# Altium schematic sheet Pi_Power.SchDoc
size A; SheetNumber: 4; SheetTotal: 10
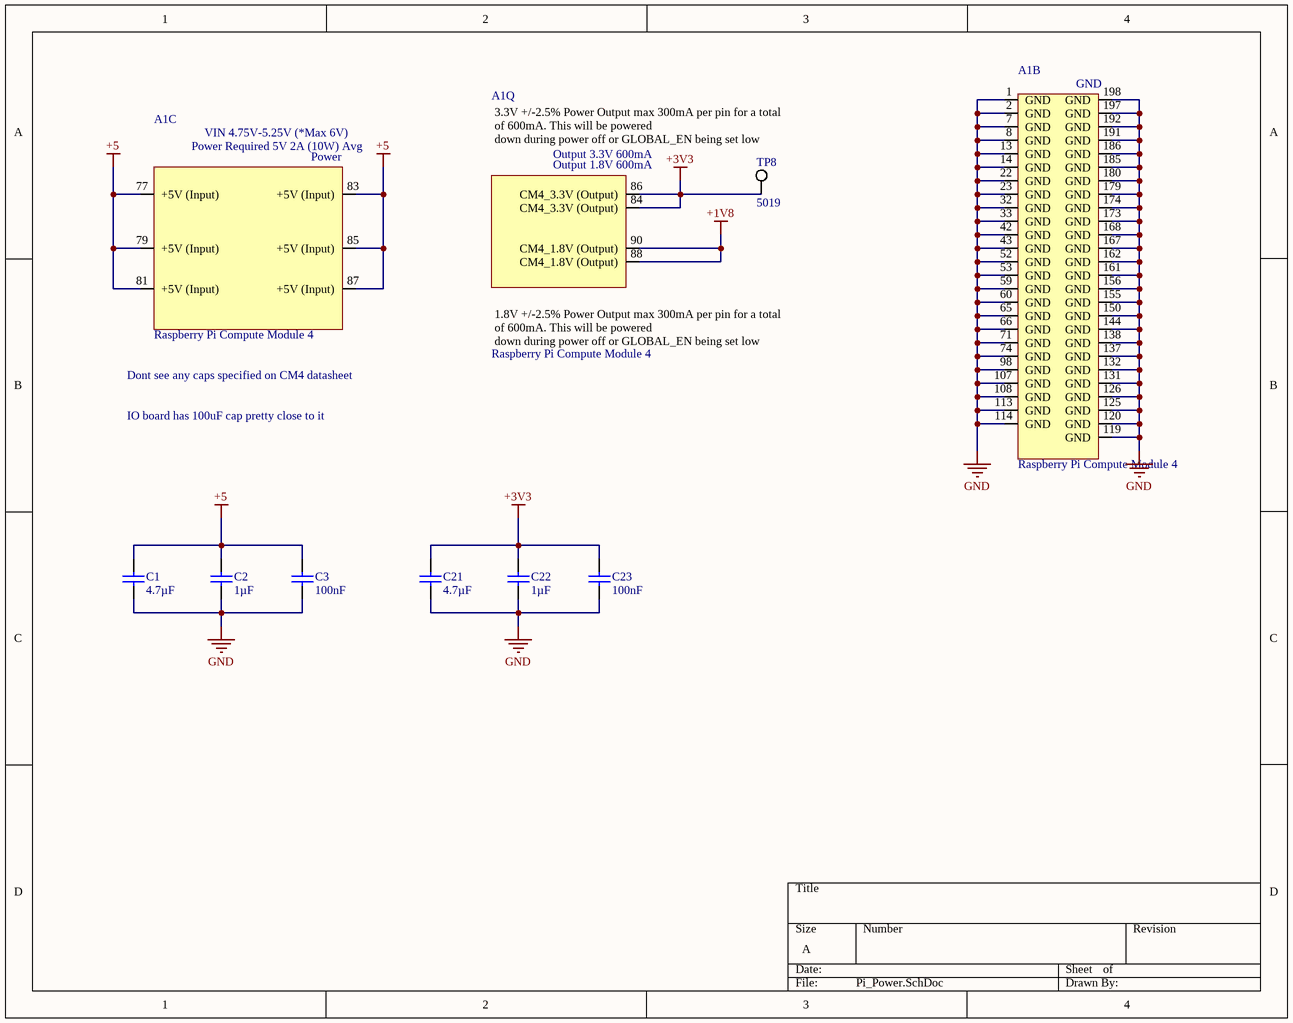
[diagram p0: Pi_Power.SchDoc]

## Parts
A1  Raspberry Pi Compute Module 4  [CM4-F40C-100DS-0.4v_1.5mm_0mm]  (parts B,C,Q of 21)  (no BOM)
C1  value 4.7µF  [CAPC0603(1608)100_L]  (hidden comment: Capacitor 4.7µF +/-20% 10V 0603)
C2  value 1µF  [CAPC1608X94X35NL15T15]  (hidden comment: Capacitor 1 uF +/- 10% 16 V 0603)
C3  value 100nF  [CAPC1005X56X25LL10T15]  (hidden comment: Capacitor 0.1 uF +/- 5% 16 V 0402)
C21  value 4.7µF  [CAPC0603(1608)100_L]  (hidden comment: Capacitor 4.7µF +/-20% 10V 0603)
C22  value 1µF  [CAPC1608X94X35NL15T15]  (hidden comment: Capacitor 1 uF +/- 10% 16 V 0603)
C23  value 100nF  [CAPC1005X56X25LL10T15]  (hidden comment: Capacitor 0.1 uF +/- 5% 16 V 0402)
TP8  5019  [KSTN-5019_V]

## Nets
+1V8: A1.88(CM4_1.8V_(Output)) A1.90(CM4_1.8V_(Output))
+3V3: A1.84(CM4_3.3V_(Output)) A1.86(CM4_3.3V_(Output)) C21.2 C22.2 C23.2 TP8.1
+5: A1.77(+5V_(Input)) A1.79(+5V_(Input)) A1.81(+5V_(Input)) A1.83(+5V_(Input)) A1.85(+5V_(Input)) A1.87(+5V_(Input)) C1.2 C2.2 C3.2
GND: A1.1(GND) A1.2(GND) A1.7(GND) A1.8(GND) A1.13(GND) A1.14(GND) A1.22(GND) A1.23(GND) A1.32(GND) A1.33(GND) A1.42(GND) A1.43(GND) A1.52(GND) A1.53(GND) A1.59(GND) A1.60(GND) A1.65(GND) A1.66(GND) A1.71(GND) A1.74(GND) A1.98(GND) A1.107(GND) A1.108(GND) A1.113(GND) A1.114(GND) A1.119(GND) A1.120(GND) A1.125(GND) A1.126(GND) A1.131(GND) A1.132(GND) A1.137(GND) A1.138(GND) A1.144(GND) A1.150(GND) A1.155(GND) A1.156(GND) A1.161(GND) A1.162(GND) A1.167(GND) A1.168(GND) A1.173(GND) A1.174(GND) A1.179(GND) A1.180(GND) A1.185(GND) A1.186(GND) A1.191(GND) A1.192(GND) A1.197(GND) A1.198(GND) C1.1 C2.1 C3.1 C21.1 C22.1 C23.1

## Notes on the sheet
- Dont see any caps specified on CM4 datasheet
- IO board has 100uF cap pretty close to it
- (in symbol CM4, part C) VIN 4.75V-5.25V (*Max 6V); Power Required 5V 2A (10W) Avg; Power; by Amornthep Phunsin
- (in symbol CM4, part Q) 3.3V +/-2.5% Power Output max 300mA per pin for a total of 600mA. This will be powered / down during power off or GLOBAL_EN being set low; Output 3.3V 600mA; Output 1.8V 600mA; 1.8V +/-2.5% Power Output max 300mA per pin for a total of 600mA. This will be powered / down during power off or GLOBAL_EN being set low

## Library data of the parts
A1 = CM4: Raspberry Pi Compute Module 4 by Amornthep Phunsin; MPN: -
C1 C21 = CMP-001-00076-4: Chip Capacitor, 4.7µF +/-20%, 10V, 0603, Thickness 1 mm; MPN: GRM188Z71A475ME15D; MFR: Murata Electronics; Tolerance: 10%; Mounting Technology: SMT; Case/Package: 0603; Pins: 2; Min Operating Temperature: -55°C; Max Operating Temperature: 85°C; Voltage Rating: 10V
C2 C22 = CMP-001-00003-6: Chip Capacitor, 1 uF, +/- 10%, 16 V, 0603 (1608 Metric); MPN: CL10A105KO8NNNC; MFR: Samsung Electro-Mechanics; Voltage Rating: 16V; Capacitor Type: Ceramic; Max Operating Temperature: 125°C; Pins: 2; Tolerance: 10%; Min Operating Temperature: -55°C; RoHS Compliant: True; Mounting Technology: SM; Case/Package: 0603
C3 C23 = CMP-001-00001-6: Chip Capacitor, 0.1 uF, +/- 5%, 16 V, 0402 (1005 Metric); MFR: Samsung Electro-Mechanics; MPN: CL05B104KP5NNNC; Capacitor Type: Ceramic; Voltage Rating: 16V; Max Operating Temperature: 125°C; Min Operating Temperature: -55°C; Case/Package: 0402; Mounting Technology: SM; Pins: 2; Tolerance: 5%; RoHS Compliant: True
TP8 = CMP-1672-00008-1: Test Point, 1 Position SMD, RoHS, Tape and Reel; MFR: Keystone Electronics; ComponentLink1Description: Manufacturer URL; Package Quantity: 1000; DatasheetVersion: 03/2014; Packaging: Tape and Reel; ComponentLink2URL: http://www.keyelco.com/product-pdf.cfm?p=1357; ComponentLink1URL: http://www.keyelco.com/; Mount: Surface Mount; Contact Plating: Silver; PackageDescription: 1-Pin Surface Mount Device, Body 3.81 x 2.03 mm; Pins: 1; RoHSCompliant: True; Mounting Technology: Surface Mount; ComponentLink2Description: Datasheet; PackageReference: 5019; MPN: 5019